# EAGLE design projekt (EAGLE 9.6.2)
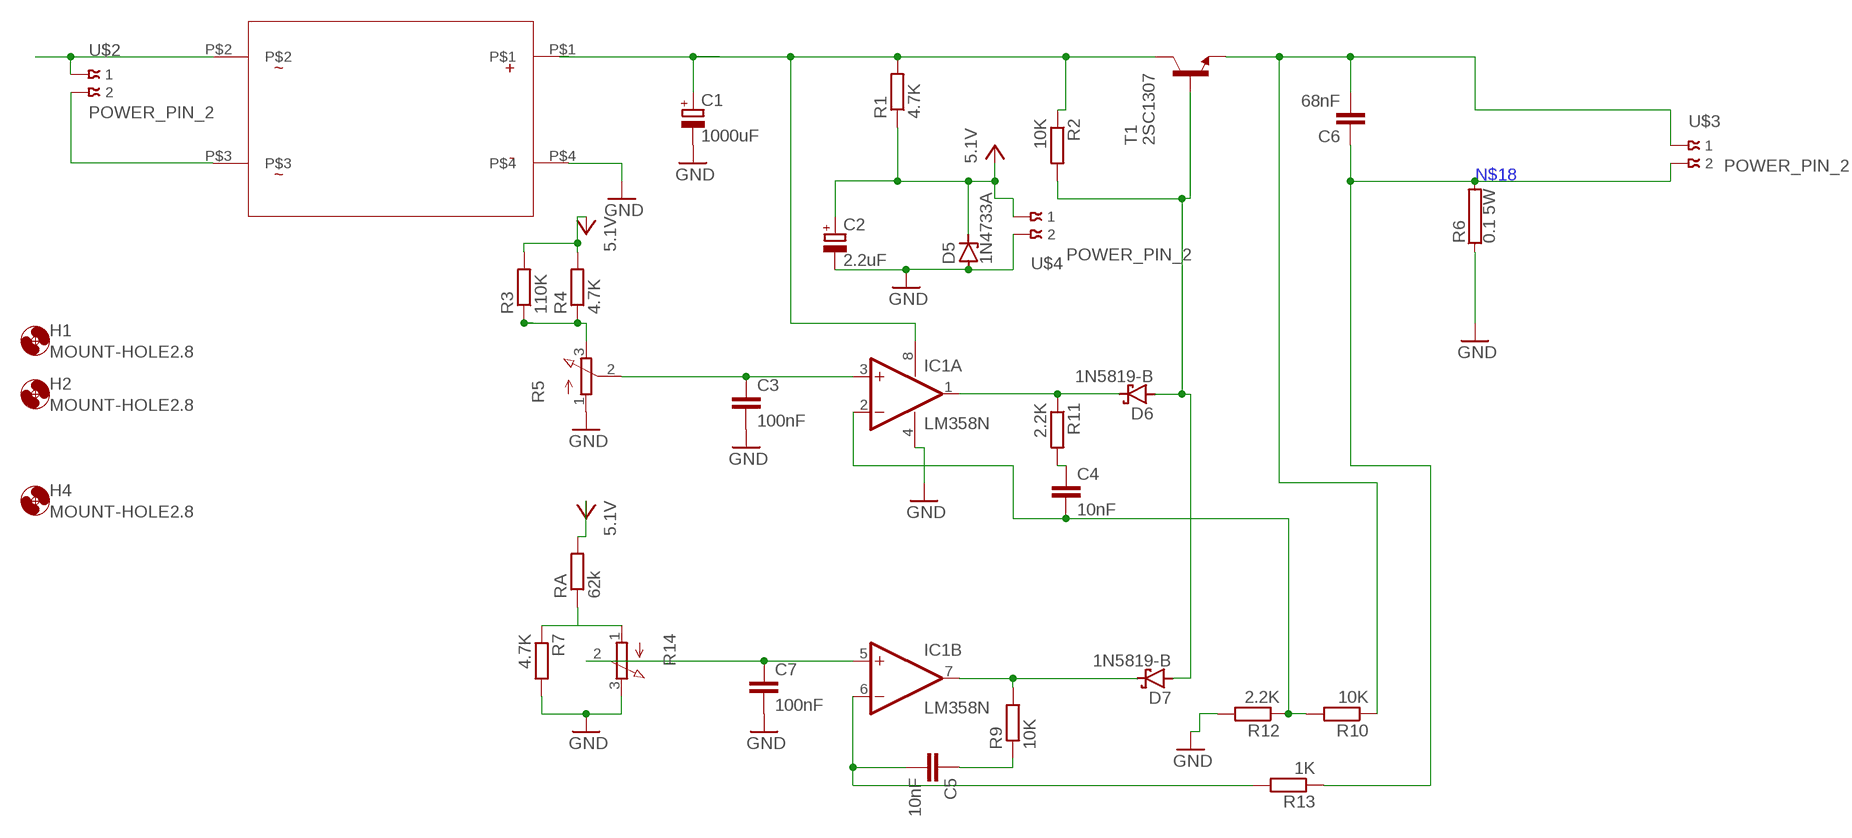
[diagram p0: schematic, sheet 1]

## Parts
C1  1000uF  CPOL-EUE7.5-18  [E7,5-18]
C2  2.2uF  CPOL-EUE2,5-6E  [E2,5-6E]
C3  100nF  C-EU050-025X075  [C050-025X075]
C4  10nF  C-EU050-025X075  [C050-025X075]
C5  10nF  C-EU050-025X075  [C050-025X075]
C6  68nF  C-EU050-025X075  [C050-025X075]
C7  100nF  C-EU050-025X075  [C050-025X075]
D5  1N4733A  ZENER-DIODEDO41Z10  [DO41Z10]
D6  1N5819-B  [DO41-7.6]
D7  1N5819-B  [DO41-7.6]
H1  MOUNT-HOLE2.8  [2,8]
H2  MOUNT-HOLE2.8  [2,8]
H4  MOUNT-HOLE2.8  [2,8]
IC1  LM358N  [DIL08]
R1  4.7K  R-EU_0207/10  [0207/10]
R2  10K  R-EU_0207/10  [0207/10]
R3  110K  R-EU_0207/10  [0207/10]
R4  4.7K  R-EU_0207/10  [0207/10]
R5  3RP/1610N  [3RP/1610N]
R6  0.1 5W  RKWP333  [KWP333]
R7  4.7K  R-EU_0207/10  [0207/10]
R9  10K  R-EU_0207/10  [0207/10]
R10  10K  R-EU_0207/10  [0207/10]
R11  2.2K  R-EU_0207/10  [0207/10]
R12  2.2K  R-EU_0207/10  [0207/10]
R13  1K  R-EU_0207/10  [0207/10]
R14  3RP/1610N  [3RP/1610N]
RA  62k  R-EU_0207/10  [0207/10]
T1  2SC1307  [TO220AV]
U$1  GBP201-YAN  [GBP201]
U$2  POWER_PIN_2  [PIN2]
U$3  POWER_PIN_2  [PIN2]
U$4  POWER_PIN_2  [PIN2]

## Nets
GND: C1.- C2.- C3.2 C7.2 D5.A IC1.4(P:V-) R5.1(A) R6.1 R7.2 R12.2 R14.3(E) U$1.P$4 U$4.P$2
N$1: C6.1 R6.2 R13.1 U$3.P$2
N$2: C1.+ IC1.8(P:V+) R1.2 R2.1 T1.2(C) U$1.P$1
N$3: C4.1 R11.2
N$4: R3.1 R4.1 R5.3(E)
N$5: D7.C IC1.7(B:OUT) R9.2
N$6: C5.1 R9.1
N$8: R7.1 R14.1(A) RA.1
N$9: C3.1 IC1.3(A:+IN) R5.2(S)
N$10: C7.1 IC1.5(B:+IN) R14.2(S)
N$11: D6.C IC1.1(A:OUT) R11.1
N$12: C4.2 IC1.2(A:-IN) R10.2 R12.1
N$13: D6.A D7.A R2.2 T1.1(B)
N$14: U$1.P$2 U$2.P$1
N$17: C5.2 IC1.6(B:-IN) R13.2
N$18: C6.2 R10.1 T1.3(E) U$3.P$1
N$19: U$1.P$3 U$2.P$2
VCC: C2.+ D5.C R1.1 R3.2 R4.2 RA.2 U$4.P$1 ; supply symbol labelled 5.1V

## Library data of the parts
C1 C2 = rcl:CPOL-EU: POLARIZED CAPACITOR, European symbol; SPICEPREFIX: C
C3-C7 = rcl:C-EU: CAPACITOR, European symbol; SPICEPREFIX: C
D5 = diode:ZENER-DIODE: Z-Diode
D6 D7 = diode:1N581*: 1.0A SCHOTTKY BARRIER RECTIFIER Source: http://www.diodes.com/datasheets/ds23001.pdf
H1 H2 H4 = holes:MOUNT-HOLE: MOUNTING HOLE with drill center marker
IC1 = linear:LM358: OP AMP also LM158; LM258; LM2904 Source: http://cache.national.com/ds/LM/LM158.pdf
R1-R4 R7 R9-R13 RA = rcl:R-EU_: RESISTOR, European symbol; SPICEPREFIX: R
R5 R14 = pot:3RP/1610N: 16mm Potentiometer one level Source: http://www.alphapotentiometers.net/html/16mm_pot_2.html
R6 = resistor-power:R: Power Resitor; OC_FARNELL: unknown; OC_NEWARK: unknown
T1 = transistor:2SC1307: NPN Transistor Silicon Epitaxial, High Frequency Power Amplifier Source: 2SC1307.pdf
U$1 = GBP201-YAN:GBP201-YAN
U$2-U$4 = PIN2:POWER_PIN_2

## Board
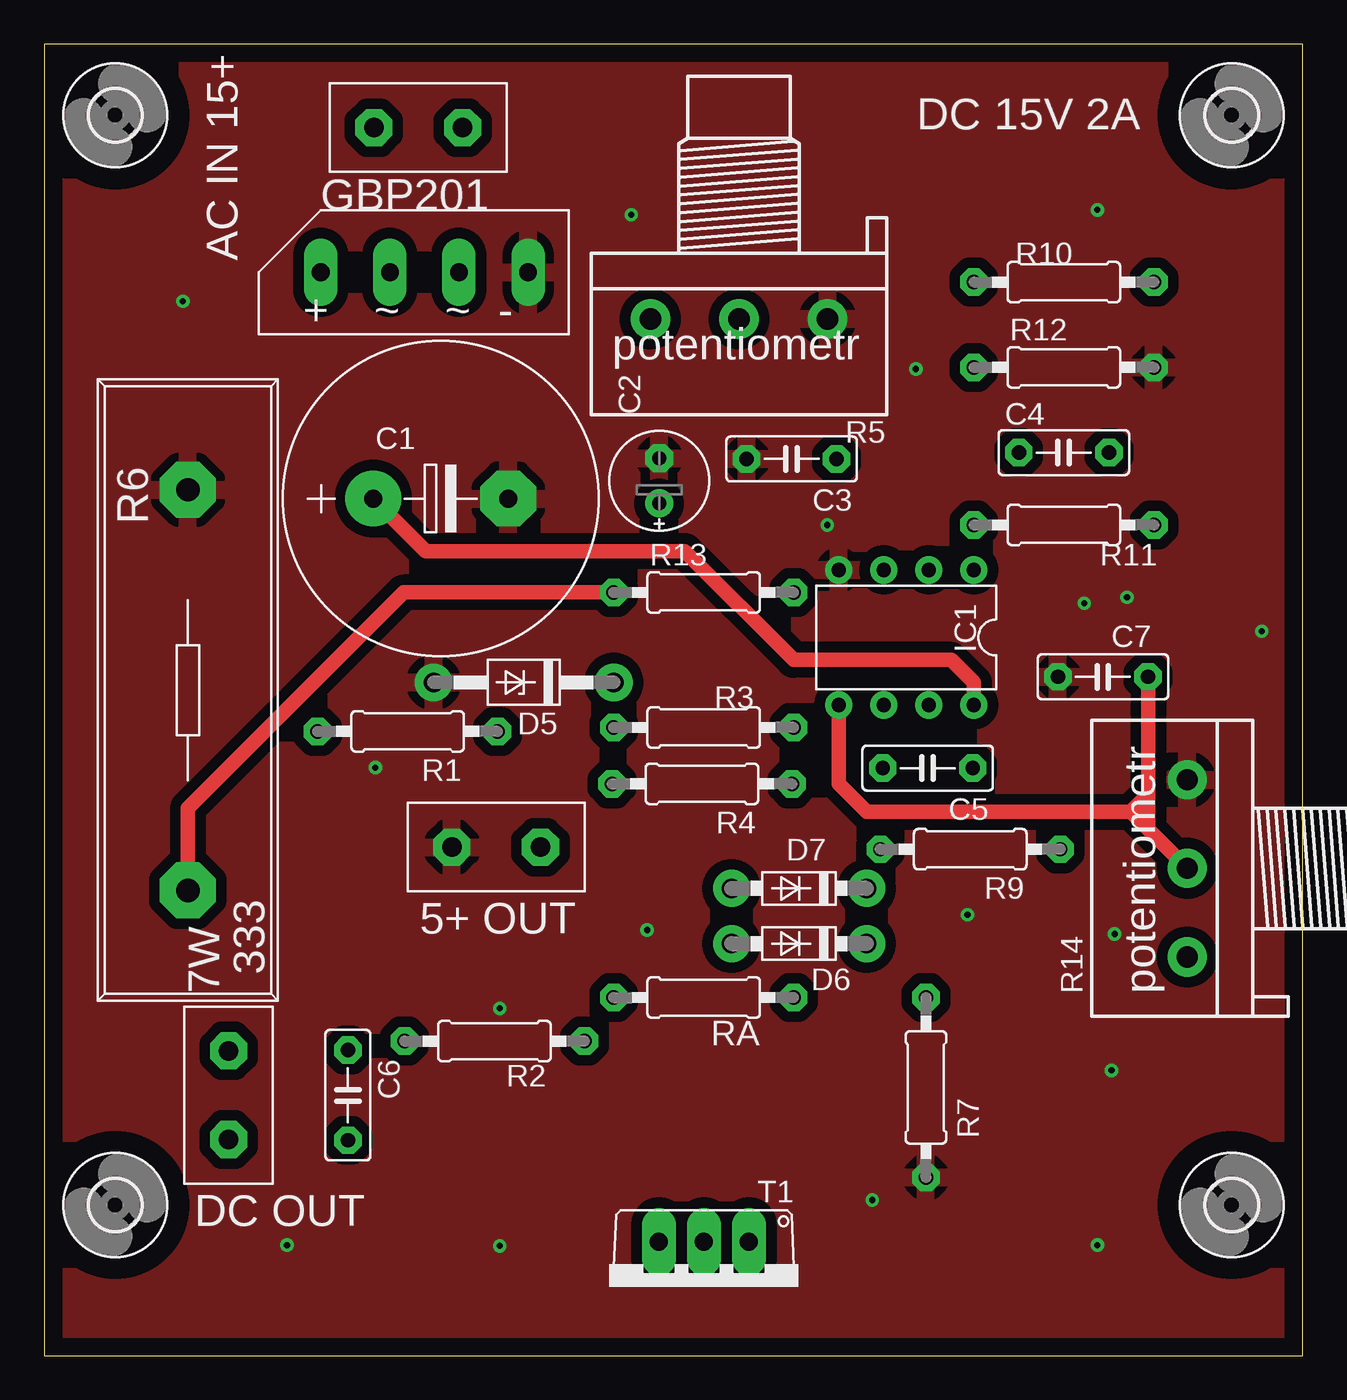
[diagram p1: board, top side]
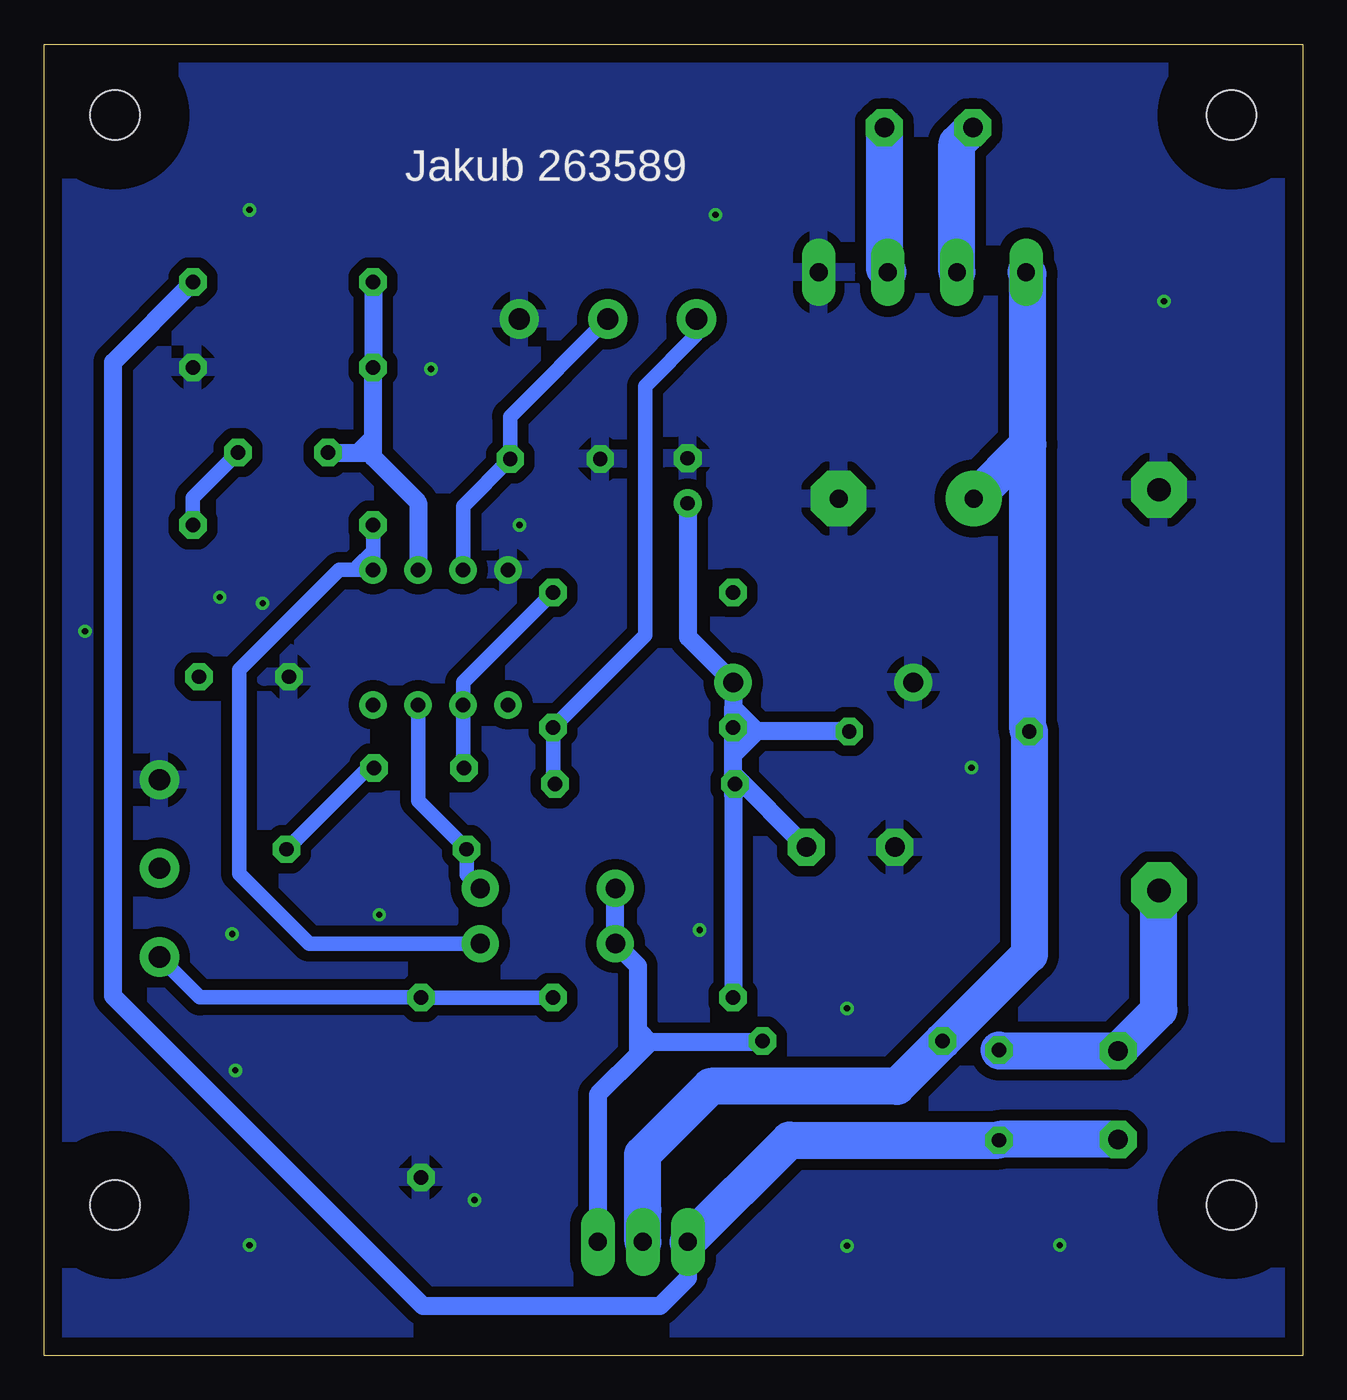
[diagram p2: board, bottom side, seen from below]

Size 71 x 74 mm. Coordinates in mm from the lower left corner, seen from the top.
Outline: 0,0 71,0 71,74 0,74 0,0
Copper layers (1*16): Top 0.035mm / dielectric 1.5mm / Bottom 0.035mm
Design rules "default *": minimum track width 20mil, minimum drill 0.35mm, track to track 20mil, track to pad 20mil, pad to pad 20mil, via to via 20mil, smd to smd 6mil, copper to edge 40mil, drill to drill 6mil, minimum pad ring 10mil, minimum via ring 8mil, stop-mask expansion 4mil, vias tented up to drill 0mil, thermal gap 20mil

### Footprints (pad centres in the part's own frame; a part is rotated, then mirrored left to right if it is on the bottom)
E7,5-18 = drill 1.016 pad 3.15: + -3.81,0 | drill 1.016 pad 3.15 octagon: - 3.81,0
E2,5-6E = drill 0.813 pad 1.575: + -1.27,0 | drill 0.813 pad 1.575 octagon: - 1.27,0
C050-025X075 = drill 0.813 octagon: 1 -2.54,0; 2 2.54,0
DO41Z10 = drill 1.118: A 5.08,0; C -5.08,0
DO41-7.6 = drill 1.1 pad 1.7: A 3.81,0; C -3.81,0
2,8 = hole 2.8: 0,0
DIL08 = drill 0.813 pad 1.27: 1 -3.81,-3.81; 2 -1.27,-3.81; 3 1.27,-3.81; 4 3.81,-3.81; 5 3.81,3.81; 6 1.27,3.81; 7 -1.27,3.81; 8 -3.81,3.81
0207/10 = drill 0.813 octagon: 1 -5.08,0; 2 5.08,0
3RP/1610N = drill 1.2 pad 2.184: 1 -5,0; 2 0,0; 3 5,0
KWP333 = drill 1.321 pad 3.15 octagon: 1 -11.303,0; 2 11.303,0
TO220AV = drill 1.016 long: 1 -2.54,-2.54; 2 0,-2.54; 3 2.54,-2.54
GBP201 = drill 1 long: P$1 0,0; P$2 3.9,0; P$3 7.8,0; P$4 11.7,0
PIN2 = drill 1.1 octagon: P$1 0,5; P$2 0,0

### Placement (x,y rotation side)
C1  22.37,48.37 0 top
C2  34.7,49.37 90 top
C3  42.17,50.6 180 top
C4  57.53,50.96 180 top
C5  49.85,33.16 180 top
C6  17.13,14.7 270 top
C7  59.74,38.31 180 top
D5  27.05,37.99 180 top
D6  42.59,23.25 180 top
D7  42.59,26.37 180 top
H1  67,70 0 top
H2  4,70 0 top
H3  MOUNT-HOLE2.8  [2,8]  4,8.5 0 top
H4  67,8.5 0 top
IC1  48.64,40.53 180 top
R1  20.5,35.23 180 top
R2  25.4,17.75 0 top
R3  37.21,35.45 180 top
R4  37.11,32.27 180 top
R5  39.2,58.5 180 top
R6  8.1,37.56 270 top
R7  49.75,15.14 270 top
R9  52.25,28.58 180 top
R10  57.53,60.58 180 top
R11  57.53,46.88 0 top
R12  57.53,55.77 0 top
R13  37.21,43.07 0 top
R14  64.5,27.5 90 top
RA  37.21,20.21 180 top
T1  37.22,3.88 180 top
U$1  15.6,61.14 0 top
U$2  23.6,69.3 90 top
U$3  10.4,17.2 180 top
U$4  23,28.7 270 top

### Tracks (layer width: path | path; a pad name or v marks a point on that pad's centre or on a via)
GND  (via drill 0.35)
  other vias: 13.7,6.24 18.68,33.18 46.72,8.78 59.42,6.24 34.02,24.02 60.22,16.1 52.1,24.88 68.7,40.88 44.18,46.88 58.68,42.46 49.18,55.68 33.12,64.38 59.42,64.66 7.82,59.5 60.4,23.8 61.1,42.8 25.7,19.6 25.7,6.2
  pour Bottom (isolate 0.61): -1.5,75.7 75.5,75.7 75.5,1.2 72.5,-1.8 1,-1.8 -0.5,-3.3 -0.5,74.7
  pour Top (isolate 0.61): -0.5,75.7 -0.5,-5.3 -1,-5.8 68.5,-5.8 73,-1.3 73,76.7 0.5,76.7
N$1
  Top 0.813: R13.1 20.27,43.07 8.1,30.9 R6.2
  Bottom 2.1: C6.1 17.09,17.2 U$3.P$2 8.1,19.5 R6.2
N$2
  Top 0.813: IC1.8 52.45,37.99 51.18,39.26 42.29,39.26 36.15,45.4 21.53,45.4 C1.+
  Bottom 2.1: 15.5,51.43 15.5,35.31 R1.2 15.42,22.65 R2.1 22.87,15.2 33.4,15.2 37.24,11.36 37.24,8.25 37.22,8.23 T1.2 | C1.+ 15.5,51.43 | 15.5,51.43 15.5,61.04 U$1.P$1
N$3
  Bottom 0.813: C4.1 62.61,48.42 R11.2
N$4
  Bottom 0.813: R5.3 34.2,57.6 37.1,54.7 37.1,40.64 R3.1 42.29,32.37 R4.1
N$5
  Bottom 0.813: D7.C 47.17,27.14 R9.2 49.91,31.32 IC1.7
N$6
  Bottom 0.813: C5.1 52.75,33.16 R9.1
N$8
  Bottom 0.813: RA.1 R7.1 62.22,20.22 R14.1
N$9
  Bottom 0.813: R5.2 44.71,52.99 C3.1 47.37,47.94 IC1.3
N$10
  Top 0.813: IC1.5 44.83,32.27 46.4,30.7 61.3,30.7 | 61.3,30.7 61.9,30.1 | 61.9,30.1 62.28,29.72 | 62.28,29.72 R14.2 | C7.1 62.28,31.68 | 62.28,31.68 61.9,31.3 | 61.9,31.3 61.3,30.7 | 61.9,30.1 61.9,31.3 | 62.28,31.68 62.28,29.72
N$11
  Bottom 0.813: R11.1 52.45,45.4 | 52.45,45.4 IC1.1 53.3,44.34 | D6.C 56.05,23.25 60,27.2 60,38.7 54.36,44.34 53.3,44.34 | 52.45,45.4 53.3,44.55 53.3,44.34
N$12
  Bottom 1.016: R10.2 R12.1 52.45,51.8 | C4.2 53.2,50.96 | 53.2,50.96 52.49,50.96 52.45,50.92 52.68,50.92 52.45,50.69 | IC1.2 49.91,48.15 52.45,50.69 | 52.45,50.69 52.45,51.8 | 52.45,51.8 53.2,51.05 53.2,50.96
N$13
  Bottom 0.813: 37.4,18.3 37.4,17.1 37.45,17.05
  Bottom 1.016: R2.2 30.53,17.7 36.8,17.7 | D7.A D6.A 38.71,23.18 38.68,23.18 37.5,22 37.5,18.4 | T1.1 39.76,14.74 37.45,17.05 | 36.8,17.7 37.45,17.05 | 36.8,17.7 37.4,18.3 37.5,18.4 | 37.5,18.4 37.5,17.1 37.45,17.05
N$14
  Bottom 2.1: U$1.P$2 19.5,68.4 U$2.P$1
N$17
  Bottom 0.813: R13.2 47.37,37.99 IC1.6 47.37,33.22 C5.2
N$18
  Bottom 1.016: R10.1 67.12,56.07 67.12,20.29 49.63,2.8 36.26,2.8 34.68,4.38 T1.3
  Bottom 2.1: T1.3 28.94,12.16 C6.2 17.09,12.2 U$3.P$1
N$19
  Bottom 2.1: U$2.P$2 23.6,61.34 U$1.P$3
VCC
  Bottom 1.016: R1.1 30.8,35.23 | 30.8,35.23 32.13,35.23 | R4.2 32.03,31.74 32.13,31.64 | 32.13,31.64 32.13,32.83 | 32.13,33.9 32.13,35.23 | 32.13,35.23 R3.2 | R3.2 32.13,36.56 30.8,35.23 | C2.+ 34.67,48.07 34.67,40.53 D5.C R3.2 | 32.13,31.64 RA.2 | 30.8,35.23 32.13,33.9 | U$4.P$1 32.13,32.83 | 32.13,32.83 32.13,33.9

### Text on the board
tNames: DC 15V 2A | AC IN 15+ | potentiometr | potentiometr | 5+ OUT | RA | DC OUT
bNames: Jakub 263589